# Altium schematic sheet Sheet1.SchDoc
size 420 x 297 mm; Address1: Address1; Address2: Address2; Address3: Address3; Address4: Address4; SheetNumber: 1; Scale: 1:1; Разраб.: Иванов; Обозначение документа: АБВГ.123456.001 Э3; Пров.: Петров; Утв.: Сидоров; Наименование организации: ОАО "Концерн "МПО-Гидроприбор"; Перв. применение: АБВГ.123456.000; Наименование изделия 1: Плата; Наименование изделия 2: Схема электрическая; Наименование изделия 3: принципиальная; Нач. отд.: Нач. отд.; Фамилия нач. отд.: Сидоров
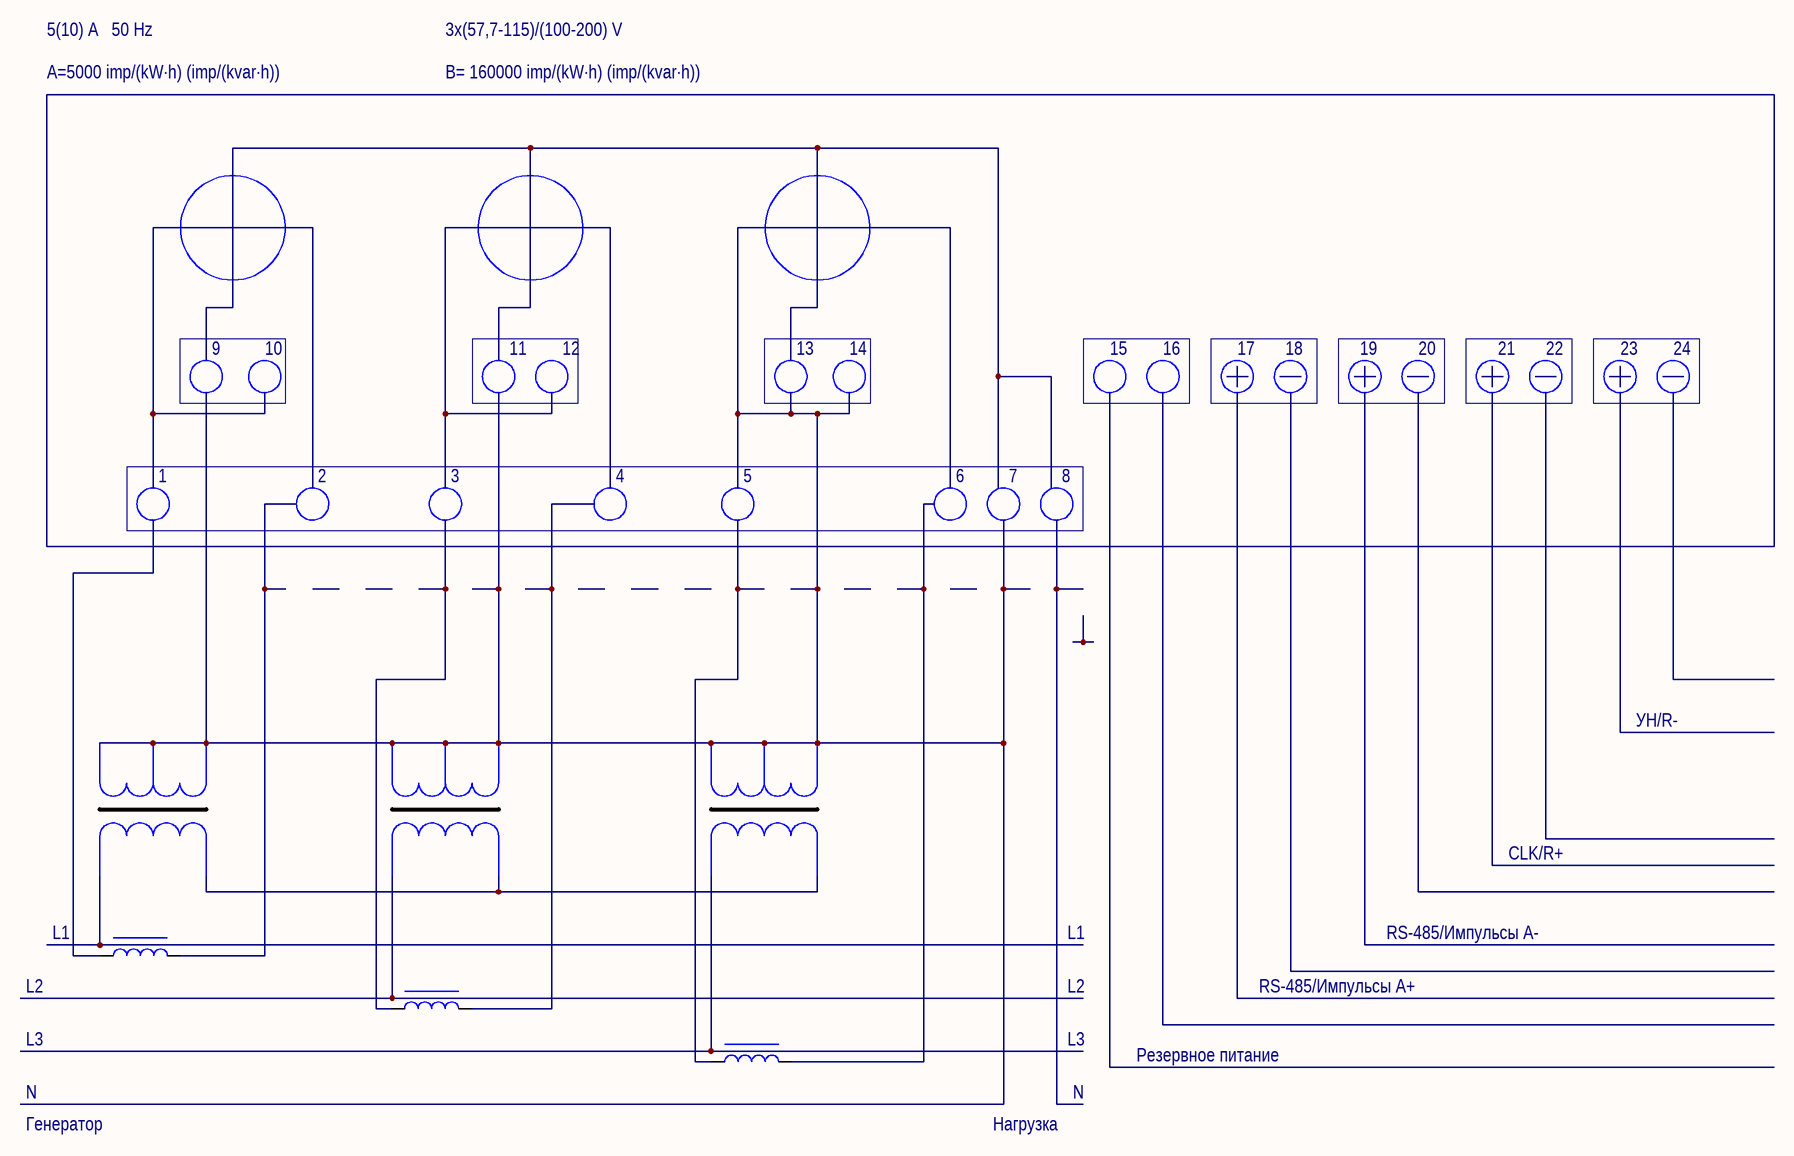
[diagram p0: Sheet1.SchDoc]

## Parts
(Parts that share a designator on the sheet are numbered #1, #2 ... from top to bottom, then left to right.)
L1  IHLP5050_1  [IHLP5050]  (value not drawn)
L2  IHLP5050_1  [IHLP5050]  (value not drawn)
L3  IHLP5050_1  [IHLP5050]  (value not drawn)
TV?#1  TC4-1W_1  [TC4-1W]  (value not drawn)
TV?#2  TC4-1W_1  [TC4-1W]  (value not drawn)
TV?#3  TC4-1W_1  [TC4-1W]  (value not drawn)

## Nets
NetTV?#1_1: TV?#1.1(SECONDARY_DOT) TV?#1.2(SECONDARY_CT) TV?#1.3(SECONDARY) TV?#2.1(SECONDARY_DOT) TV?#2.2(SECONDARY_CT) TV?#2.3(SECONDARY) TV?#3.1(SECONDARY_DOT) TV?#3.2(SECONDARY_CT) TV?#3.3(SECONDARY)
NetTV?#1_4: TV?#1.4(PRIMARY) TV?#2.4(PRIMARY) TV?#3.4(PRIMARY)

Not connected (* = marked no-connect by the designer): L1 1 2; L2 1 2; L3 1 2; TV?#1 6(PRIMARY_DOT_); TV?#2 6(PRIMARY_DOT_); TV?#3 6(PRIMARY_DOT_)

## Notes on the sheet
- 5(10) A   50 Hz
- A=5000 imp/(kW·h) (imp/(kvar·h))
- 3x(57,7-115)/(100-200) V
- B= 160000 imp/(kW·h) (imp/(kvar·h))
- 9
- 10
- 11
- 12
- 13
- 14
- 15
- 16
- 17
- 18
- 19
- 20
- 21
- 22
- 23
- 24
- 1
- 2
- 3
- 4
- 5
- 6
- 7
- 8
- УН/R-
- CLK/R+
- L1
- RS-485/Импульсы А-
- L2
- RS-485/Импульсы А+
- N
- L3
- Резервное питание
- Генератор
- Нагрузка
- Перв. примен.
- Справ. №
- Подп. и дата
- Инв. № дубл.
- Взам. инв. №
- Разраб.
- Изм.
- Лист
- № докум.
- Подп.
- Дата
- Лит.
- Масса
- Масштаб
- Пров.
- Т.контр.
- Листов
- Инв. № подл.
- Утв.
- Н.контр.
- Копировал
- Формат А3

## Library data of the parts
L1-L3 = IHLP5050_1: Value: 10u; Name: IHLP5050_1; MPN: IHLP5050_1; LibraryPath: _library\sch\inductors.schlib; FootprintPath: _library\pcb\inductor.pcblib; ComponentLink1URL: D:\_library\pdf\inductor\vishay~ihlp-5050ce-01.pdf; ComponentLink1Description: datasheet; ComponentLink2URL: http://www.vishay.com/search?query=ihlp6767&searchChoice=part; ComponentLink2Description: site
TV?#1-TV?#3 = TC4-1W_1: Surface mount RF transformer Operating Temperature -40°C to 85°C   DC Current 30mA; Voltage/Power: 0.25W; analogue: TC4-1W+; Name: TC4-1W_1; MPN: TC4-1W_1; ComponentLink1URL: site; ComponentLink2URL: https://ww2.minicircuits.com/pdfs/TC4-1W.pdf; price elitan 1000pc: 308